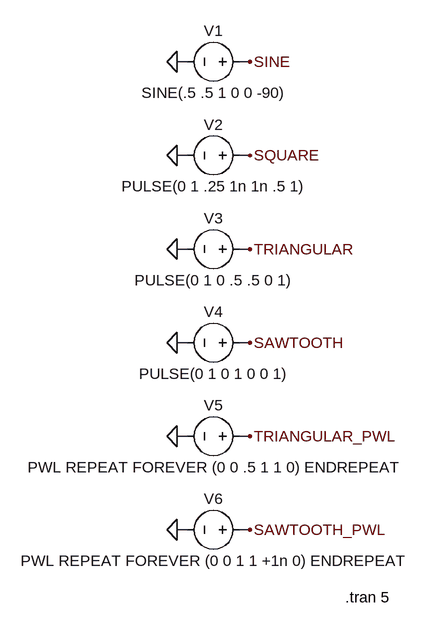
[diagram p0: schematic TriangularSawtoothWaveforms.asc]
TriangularSawtoothWaveforms.asc, the LTspice schematic file:
Version 4
SHEET 1 1748 680
WIRE 16 -608 0 -608
WIRE 112 -608 96 -608
WIRE 16 -464 0 -464
WIRE 112 -464 96 -464
WIRE 16 -320 0 -320
WIRE 112 -320 96 -320
WIRE 16 -176 0 -176
WIRE 112 -176 96 -176
WIRE 16 -32 0 -32
WIRE 112 -32 96 -32
WIRE 16 112 0 112
WIRE 112 112 96 112
FLAG 0 -320 0
FLAG 112 -320 TRIANGULAR
FLAG 0 -464 0
FLAG 112 -464 SQUARE
FLAG 0 -176 0
FLAG 112 -176 SAWTOOTH
FLAG 0 -608 0
FLAG 112 -608 SINE
FLAG 0 -32 0
FLAG 112 -32 TRIANGULAR_PWL
FLAG 0 112 0
FLAG 112 112 SAWTOOTH_PWL
SYMBOL voltage 112 -320 R90
WINDOW 123 74 56 VTop 2
WINDOW 39 53 56 VTop 2
WINDOW 0 -32 56 VBottom 2
WINDOW 3 32 56 VTop 2
SYMATTR InstName V3
SYMATTR Value PULSE(0 1 0 .5 .5 0 1)
SYMBOL voltage 112 -464 R90
WINDOW 123 74 56 VTop 2
WINDOW 39 53 56 VTop 2
WINDOW 0 -32 56 VBottom 2
WINDOW 3 32 56 VTop 2
SYMATTR InstName V2
SYMATTR Value PULSE(0 1 .25 1n 1n .5 1)
SYMBOL voltage 112 -176 R90
WINDOW 123 74 56 VTop 2
WINDOW 39 53 56 VTop 2
WINDOW 0 -32 56 VBottom 2
WINDOW 3 32 56 VTop 2
SYMATTR InstName V4
SYMATTR Value PULSE(0 1 0 1 0 0 1)
SYMBOL voltage 112 -608 R90
WINDOW 123 74 56 VTop 2
WINDOW 39 53 56 VTop 2
WINDOW 0 -32 56 VBottom 2
WINDOW 3 32 56 VTop 2
SYMATTR InstName V1
SYMATTR Value SINE(.5 .5 1 0 0 -90)
SYMBOL voltage 112 -32 R90
WINDOW 123 74 56 VTop 2
WINDOW 39 53 56 VTop 2
WINDOW 0 -32 56 VBottom 2
WINDOW 3 32 56 VTop 2
SYMATTR InstName V5
SYMATTR Value PWL REPEAT FOREVER (0 0 .5 1 1 0) ENDREPEAT
SYMBOL voltage 112 112 R90
WINDOW 0 -32 56 VBottom 2
WINDOW 3 32 56 VTop 2
SYMATTR InstName V6
SYMATTR Value PWL REPEAT FOREVER (0 0 1 1 +1n 0) ENDREPEAT
TEXT 328 216 Right 2 !.tran 5

The netlist it stands for:
* TriangularSawtoothWaveforms.asc
V3 TRIANGULAR 0 PULSE(0 1 0 .5 .5 0 1)
V2 SQUARE 0 PULSE(0 1 .25 1n 1n .5 1)
V4 SAWTOOTH 0 PULSE(0 1 0 1 0 0 1)
V1 SINE 0 SINE(.5 .5 1 0 0 -90)
V5 TRIANGULAR_PWL 0 PWL REPEAT FOREVER (0 0 .5 1 1 0) ENDREPEAT
V6 SAWTOOTH_PWL 0 PWL REPEAT FOREVER (0 0 1 1 +1n 0) ENDREPEAT
.tran 5
.backanno
.end